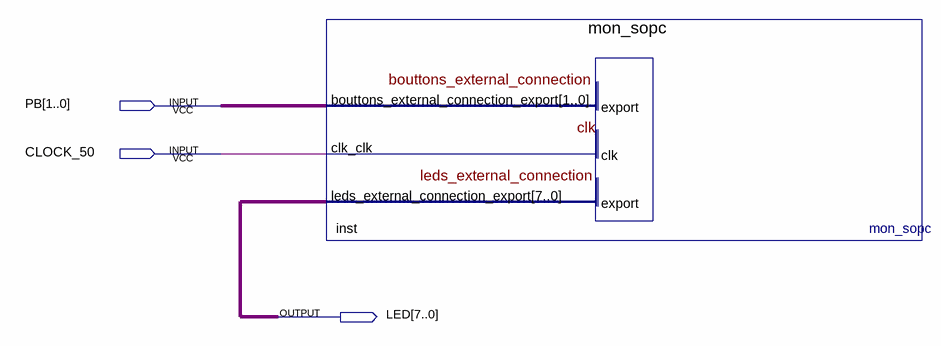
[diagram p0: schematic sheet]
// Quartus schematic sopc_compteur.bdf as structural Verilog: 1 symbols, 3 pins
module sopc_compteur (
  input  [1:0] PB,
  input  CLOCK_50,
  output [7:0] LED
);

  mon_sopc inst (.bouttons_external_connection_export(PB), .clk_clk(CLOCK_50), .leds_external_connection_export(LED));
endmodule
